# EAGLE design 5vldo_FETsw (EAGLE 6.5.0)
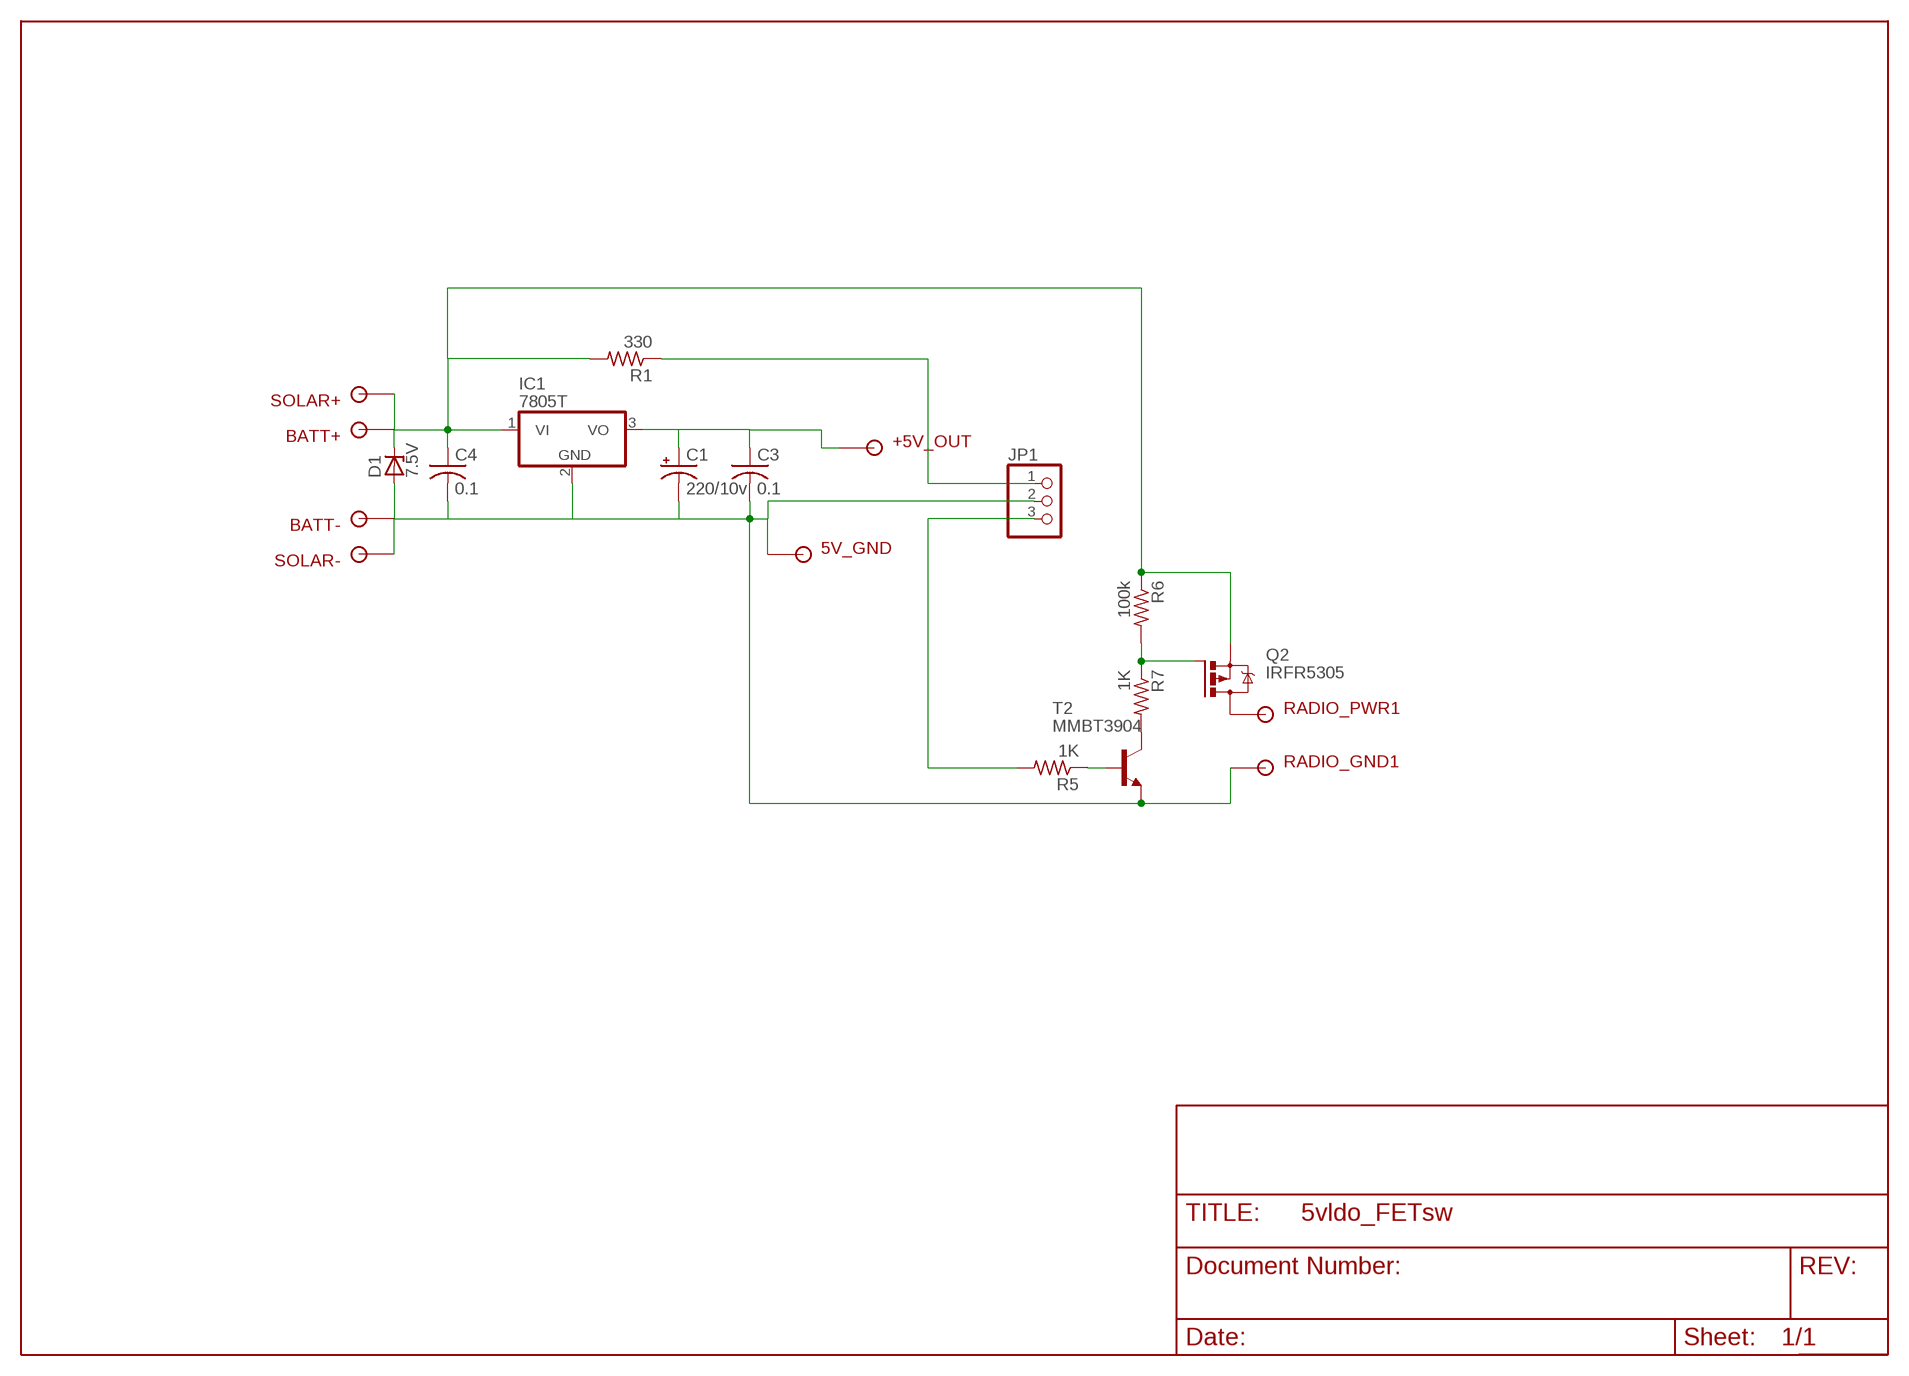
[diagram p0: schematic, sheet 1]

## Parts
5V_GND  SOLDER_POINTD  [P1-17Y]
+5V_OUT  SOLDER_POINTD  [P1-17Y]
BATT+  SOLDER_POINTD  [P1-17Y]
BATT-  SOLDER_POINTD  [P1-17Y]
C1  220/10v  CPOL-USSMCB  [SMC_B]
C3  0.1  C-USC0805  [C0805]
C4  0.1  C-USC0805  [C0805]
D1  7.5V  ZENER-DIODESMB  [SMB]
IC1  7805T  [TO220H]
JP1  PINHD-1X3  [1X03]
Q2  IRFR5305  [D-PAK_TO252AA]
R1  330  R-US_R0603  [R0603]
R5  1K  R-US_R0603  [R0603]
R6  100k  R-US_R0603  [R0603]
R7  1K  R-US_R0603  [R0603]
RADIO_GND1  SOLDER_POINTD  [P1-17Y]
RADIO_PWR1  SOLDER_POINTD  [P1-17Y]
SOLAR+  SOLDER_POINTD  [P1-17Y]
SOLAR-  SOLDER_POINTD  [P1-17Y]
T2  MMBT3904  MMBT3904LT1-NPN-SOT23-BEC  [SOT23-BEC]

## Nets
N$1: BATT+.1 C4.1 D1.C IC1.1(VI) Q2.3(S) R1.2 R6.1 SOLAR+.1
N$3: +5V_OUT.1 C1.+ C3.1 IC1.3(VO)
N$4: JP1.1 R1.1
N$11: 5V_GND.1 BATT-.1 C1.- C3.2 C4.2 D1.A IC1.2(GND) JP1.2 RADIO_GND1.1 SOLAR-.1 T2.E
N$12: JP1.3 R5.2
N$13: R5.1 T2.B
N$14: R7.2 T2.C
N$15: Q2.1(G) R6.2 R7.1
N$16: Q2.4(D) RADIO_PWR1.1

## Library data of the parts
5V_GND +5V_OUT BATT+ BATT- RADIO_GND1 RADIO_PWR1 SOLAR+ SOLAR- = 1AA_Stofer:SOLDER_POINT
C1 = rcl:CPOL-US: POLARIZED CAPACITOR, American symbol
C3 C4 = rcl:C-US: CAPACITOR, American symbol
D1 = diode:ZENER-DIODE: Z-Diode
IC1 = linear:78*: Positive VOLTAGE REGULATOR Source: http://cache.national.com/ds/LM/LM78L05.pdf http://www.fairchildsemi.com/ds/LM/LM7805.pdf
JP1 = 1AA_Stofer:PINHD-1X3: PIN HEADER
Q2 = transistor-power:IRF?5305: HEXFET Power MOSFET Source: http://www.irf.com/product-info/datasheets/data/irfr5305pbf.pdf
R1 R5-R7 = rcl:R-US_: RESISTOR, American symbol
T2 = transistor:*-NPN-: NPN Transistror BF959 corrected 2008.03.06

## Board
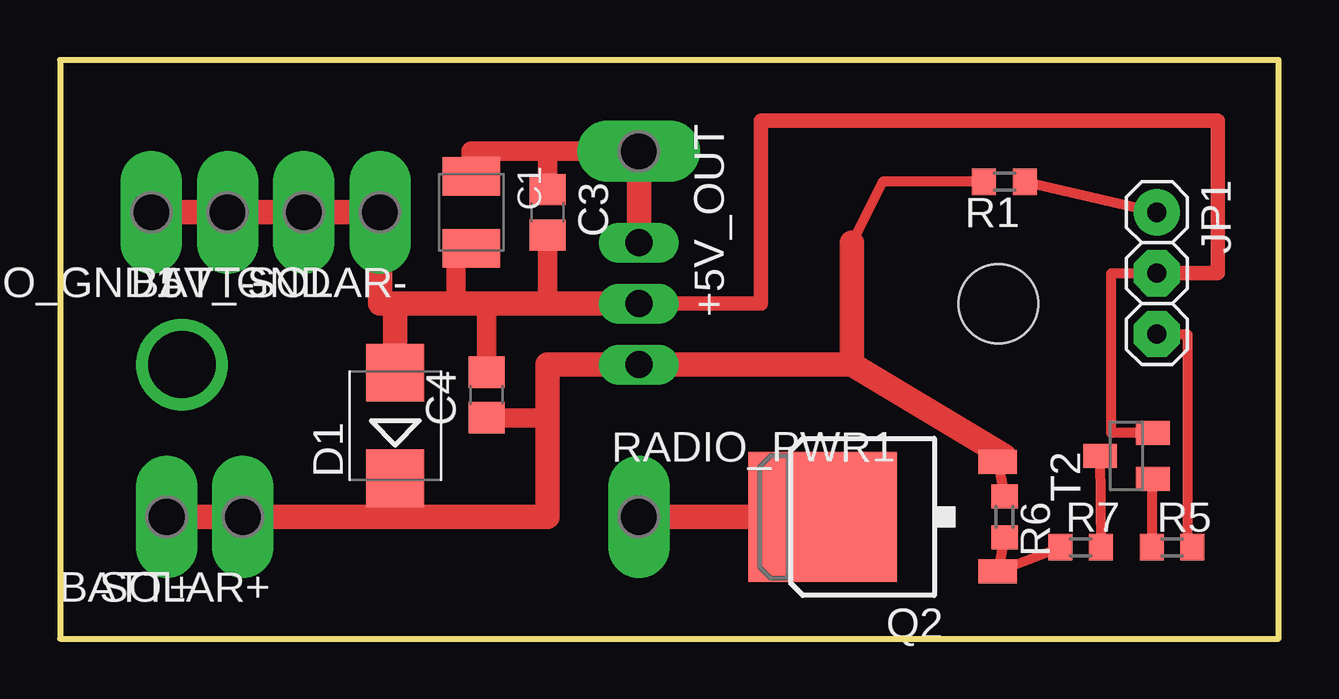
[diagram p1: board, top side]
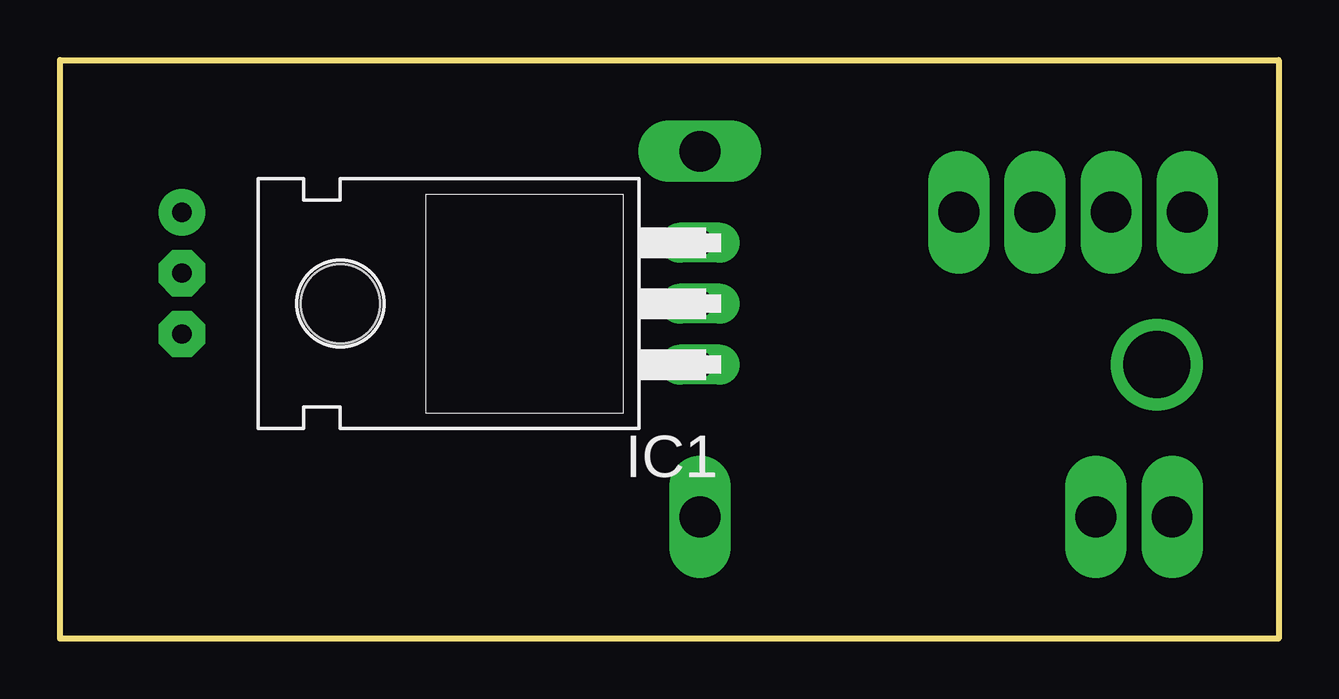
[diagram p2: board, bottom side, seen from below]

Size 50.8 x 24.13 mm. Coordinates in mm from the lower left corner, seen from the top.
Outline: 0,24.13 0,0 50.8,0 50.8,24.13 0,24.13
Copper layers (1*16): Top 0.035mm / dielectric 1.5mm / Bottom 0.035mm
Design rules "default": minimum track width 10mil, minimum drill 24mil, track to track 8mil, track to pad 8mil, pad to pad 8mil, via to via 8mil, smd to smd 8mil, copper to edge 40mil, drill to drill 8mil, minimum pad ring 10mil, minimum via ring 8mil, stop-mask expansion 4mil, vias tented up to drill 0mil, thermal gap 10mil

### Footprints (pad centres in the part's own frame; a part is rotated, then mirrored left to right if it is on the bottom)
P1-17Y = drill 1.702 pad 2.121 long: 1 0,0
SMC_B = smd 1.6 x 2.4: + -1.5,0; - 1.5,0
C0805 = smd 1.3 x 1.5: 1 -0.95,0; 2 0.95,0
SMB = smd 2.4 x 2.4: A 2.2,0; C -2.2,0
TO220H = drill 1.118 long: 1 -2.54,-10.16; 2 0,-10.16; 3 2.54,-10.16 | hole 3.302: 0,4.826
1X03 = drill 0.8 pad 1.93: 1 -2.54,0 | drill 0.8 pad 1.93 octagon: 2 0,0; 3 2.54,0
D-PAK_TO252AA = smd 1 x 1.6: 1 -2.28,-4.8; 3 2.28,-4.8 | smd 5.4 x 6.2: 4 0,2.5
R0603 = smd 1 x 1.1: 1 -0.85,0; 2 0.85,0
SOT23-BEC = smd 1 x 1.4: B -0.95,-1.1; C 0,1.1; E 0.95,-1.1

### Placement (x,y rotation side)
5V_GND  10.16,17.78 180 top
+5V_OUT  24.13,20.32 270 top
BATT+  4.45,5.08 180 top
BATT-  6.98,17.78 180 top
C1  17.14,17.78 270 top
C3  20.32,17.78 270 top
C4  17.78,10.16 90 top
D1  13.97,8.89 90 top
IC1  34.29,13.97 90 bottom
JP1  45.72,15.24 270 top
Q2  34.29,5.08 90 top
R1  39.37,19.05 180 top
R5  46.35,3.81 0 top
R6  39.37,5.08 270 top
R7  42.55,3.81 0 top
RADIO_GND1  3.81,17.78 180 top
RADIO_PWR1  24.13,5.08 0 top
SOLAR+  7.62,5.08 180 top
SOLAR-  13.34,17.78 180 top
T2  44.45,7.62 90 top

### Tracks (layer width: path | path; a pad name or v marks a point on that pad's centre or on a via)
N$1
  Top 0.406: Q2.3 R6.1 | R1.2 34.29,19.05 33.02,16.51 | 7.62,5.4 SOLAR+.1
  Top 0.813: C4.1 20.32,9.21 20.32,8.89
  Top 1.016: 33.02,16.51 33.02,11.43 | 33.02,11.43 39.37,7.62 39.09,7.62 Q2.3 | SOLAR+.1 13.97,5.08 | SOLAR+.1 BATT+.1 SOLAR+.1 | D1.C 13.97,5.08 | 33.02,11.43 IC1.1 20.32,11.43 20.32,8.89 20.32,5.08 13.97,5.08
N$2  (via drill 2.8)
  other vias: 5.08,11.43
N$3
  Top 0.813: +5V_OUT.1 20.32,20.32 | 20.32,20.32 17.14,20.32 C1.+ | C3.1 20.32,20.32
  Top 1.016: +5V_OUT.1 IC1.3
N$4
  Top 0.406: R1.1 JP1.1
N$11
  Top 0.406: T2.E 43.81,8.57 43.81,15.24 JP1.2
  Top 0.61: JP1.2 48.26,15.24 48.26,21.59 29.21,21.59 29.21,13.97 IC1.2
  Top 0.813: C1.- 16.51,16.28 16.51,13.97 | C3.2 20.32,13.97 | C4.2 17.78,13.97
  Top 1.016: RADIO_GND1.1 BATT-.1 5V_GND.1 SOLAR-.1 13.34,13.97 13.97,13.97 | D1.A 13.97,13.97 | IC1.2 20.32,13.97 17.78,13.97 16.51,13.97 13.97,13.97
N$12
  Top 0.406: JP1.3 46.99,12.7 46.99,3.81 R5.2
N$13
  Top 0.406: T2.B 45.51,6.67 R5.1
N$14
  Top 0.406: T2.C R7.2
N$15
  Top 0.406: R6.2 Q2.1 R7.1
N$16
  Top 1.016: Q2.4 RADIO_PWR1.1